# Altium schematic sheet [04] CH340.SchDoc
size A4
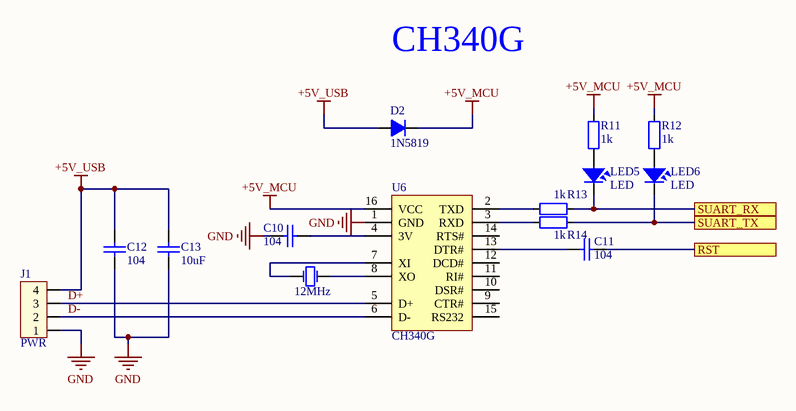
[diagram p0: [04] CH340.SchDoc]

## Parts
C10  104  [CAP_0805]
C11  104  [CAP_0805]
C12  104  [CAP_0805]
C13  10uF  [CAP_0805]
D2  1N5819  [DO-214AB SMA]
J1  PWR  [HED4B]
LED5  LED  [LED-0805-Green]
LED6  LED  [LED-0805-Green]
R11  1k  [RES-SMD-0805]
R12  1k  [RES-SMD-0805]
R13  1k  [RES-SMD-0805]
R14  1k  [RES-SMD-0805]
U6  CH340G  [SO16]
Y2  12MHz  [XTAL 5032 SMD]

## Ports
RST, SUART_RX, SUART_TX

## Nets
+5V_MCU: D2.2(K) R11.2 R12.2 U6.16(VCC)
+5V_USB: C12.2 C13.2 D2.1(A) J1.4
GND: C10.1 C12.1 C13.1 J1.1 U6.1(GND)
D+: J1.3 U6.5(D+)
D-: J1.2 U6.6(D-)
RST: C11.2 ; port RST
SUART_RX: LED5.2 R13.2 ; port SUART_RX
SUART_TX: LED6.2 R14.2 ; port SUART_TX
NetC10_2: C10.2 U6.4(3V)
NetC11_1: C11.1 U6.13(DTR#)
NetLED5_1: LED5.1 R11.1
NetLED6_1: LED6.1 R12.1
NetR13_1: R13.1 U6.2(TXD)
NetR14_1: R14.1 U6.3(RXD)
NetU6_7: U6.7(XI) Y2.1(OSC1)
NetU6_8: U6.8(XO) Y2.2(OSC2)

Not connected (* = marked no-connect by the designer): U6 9(CTR#) 10(DSR#) 11(RI#) 12(DCD#) 14(RTS#) 15(RS232)

## Notes on the sheet
- CH340G

## Library data of the parts
C10-C13 = CapSMD: Capacitor; Value: 33p; Published: 8-Jun-2000; LatestRevisionDate: 17-Jul-2002; LatestRevisionNote: Re-released for DXP Platform.; PackageReference: RAD-0.3; Publisher: Altium Limited
D2 = D1A_1: Diode 1A; Value: 1N4007
J1 = Hed4: Header 4 (Green); Value: Header 4
LED5 LED6 = LED: LED Single colour Green and Red; Value: LED 3 ly Single Colour
R11-R14 = Resistor - SMD: Resistor; Manufacturer: Generic Components; Class: Passive; Published: 08/06/2000; Publisher: Altium Hobart Technology Centre
U6 = CH340G: High and Low Side Driver; Note: Pins 4, 8 and 14 are not connected; Published: 8-Jun-2000; LatestRevisionDate: 04-Mar-2005; LatestRevisionNote: Stylized 3D Model Added.; DatasheetVersion: PD60147J; PackageReference: PDIP14; Publisher: Altium Limited; PackageDescription: DIP; 14 Leads; Row Spacing 7.62 mm; Pitch 2.54 mm; ComponentLink1Description: Manufacturer Link; ComponentLink1URL: http://www.irf.com/; ComponentLink2Description: Datasheet; ComponentLink2URL: http://www.irf.com/product-info/datasheets/data/ir2110.pdf
Y2 = XTAL: Crystal Oscillator; Published: 8-Jun-2000; LatestRevisionDate: 17-Jul-2002; LatestRevisionNote: Re-released for DXP Platform.; PackageReference: R38; Publisher: Altium Limited